# Altium schematic sheet modFOC-Top.SchDoc: modFOC-Top MCU
size A4; Author: Thomas Hofmann; CompanyName: HTL St. Pölten; Organization: Altium Limited; Address1: modFOC; Address2: Frenchs Forest; Address3: NSW; Address4: Australia 2086; DocumentNumber: 1; Revision: 2.0; SheetNumber: 1; SheetTotal: 7
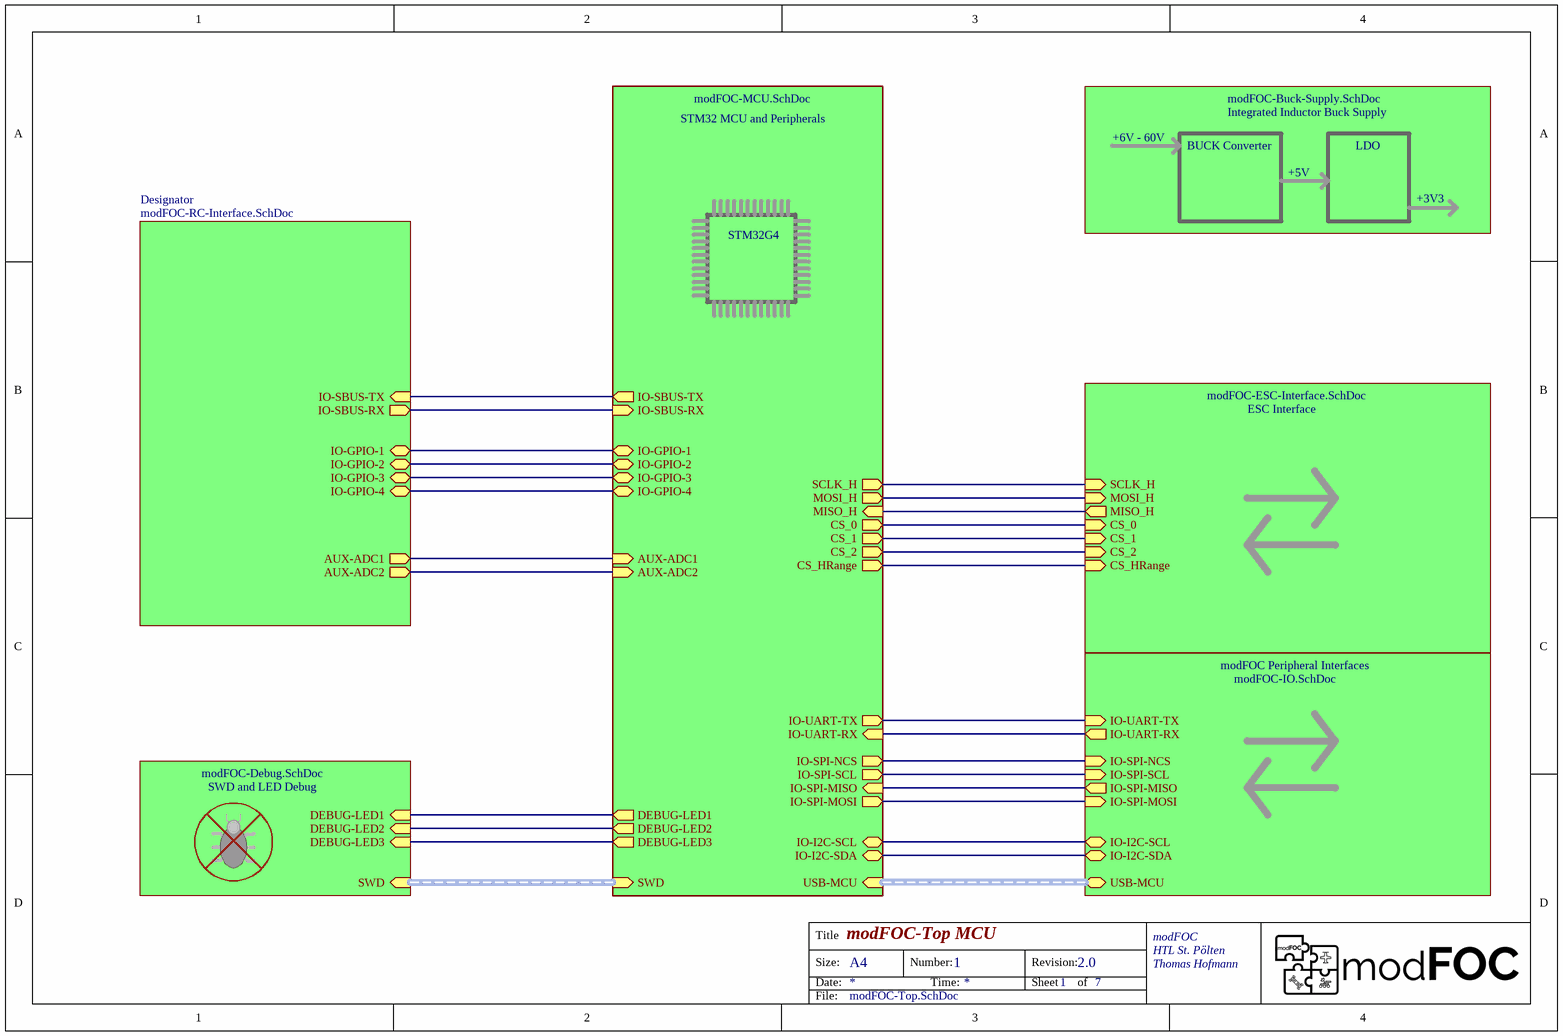
[diagram p0: modFOC-Top.SchDoc]

## Sub-sheets
Designator = modFOC-RC-Interface.SchDoc: IO-SBUS-TX (in), IO-SBUS-RX (out), IO-GPIO-1 (bidir), AUX-ADC2 (out), IO-GPIO-4 (bidir), AUX-ADC1 (out), IO-GPIO-3 (bidir), IO-GPIO-2 (bidir)
ESC Interface = modFOC-ESC-Interface.SchDoc: SCLK_H (in), MOSI_H (in), MISO_H (out), CS_0 (in), CS_1 (in), CS_2 (in), CS_HRange (in)
Integrated Inductor Buck Supply = modFOC-Buck-Supply.SchDoc: no entries
modFOC Peripheral Interfaces = modFOC-IO.SchDoc: USB-MCU (bidir, harness USB-HARNESS), IO-I2C-SDA (bidir), IO-I2C-SCL (bidir), IO-SPI-MOSI (in), IO-SPI-MISO (out), IO-SPI-SCL (in), IO-SPI-NCS (in), IO-UART-RX (out), IO-UART-TX (in)
STM32 MCU and Peripherals = modFOC-MCU.SchDoc: USB-MCU (in, harness USB-HARNESS), SWD (in, harness SWD-HARNESS), DEBUG-LED3 (out), DEBUG-LED2 (out), DEBUG-LED1 (out), IO-I2C-SDA (bidir), IO-I2C-SCL (bidir), IO-SPI-MOSI (out), IO-SPI-MISO (in), IO-SPI-SCL (out), IO-SPI-NCS (out), IO-UART-RX (in), IO-UART-TX (out), SCLK_H (out), MOSI_H (out), MISO_H (in), CS_0 (out), CS_1 (out), CS_2 (out), CS_HRange (out), IO-SBUS-TX (out), IO-SBUS-RX (in), IO-GPIO-1 (bidir), AUX-ADC2 (in), IO-GPIO-4 (bidir), AUX-ADC1 (in), IO-GPIO-3 (bidir), IO-GPIO-2 (bidir)
SWD and LED Debug = modFOC-Debug.SchDoc: SWD (in, harness SWD-HARNESS), DEBUG-LED3 (in), DEBUG-LED2 (in), DEBUG-LED1 (in)

## Nets
(unnamed): sheet modFOC Peripheral Interfaces/IO-I2C-SDA, sheet STM32 MCU and Peripherals/IO-I2C-SDA
(unnamed): sheet modFOC Peripheral Interfaces/IO-I2C-SCL, sheet STM32 MCU and Peripherals/IO-I2C-SCL
(unnamed): sheet modFOC Peripheral Interfaces/IO-SPI-MOSI, sheet STM32 MCU and Peripherals/IO-SPI-MOSI
(unnamed): sheet modFOC Peripheral Interfaces/IO-SPI-MISO, sheet STM32 MCU and Peripherals/IO-SPI-MISO
(unnamed): sheet modFOC Peripheral Interfaces/IO-SPI-SCL, sheet STM32 MCU and Peripherals/IO-SPI-SCL
(unnamed): sheet modFOC Peripheral Interfaces/IO-SPI-NCS, sheet STM32 MCU and Peripherals/IO-SPI-NCS
(unnamed): sheet modFOC Peripheral Interfaces/IO-UART-RX, sheet STM32 MCU and Peripherals/IO-UART-RX
(unnamed): sheet modFOC Peripheral Interfaces/IO-UART-TX, sheet STM32 MCU and Peripherals/IO-UART-TX
(unnamed): sheet STM32 MCU and Peripherals/DEBUG-LED3, sheet SWD and LED Debug/DEBUG-LED3
(unnamed): sheet STM32 MCU and Peripherals/DEBUG-LED2, sheet SWD and LED Debug/DEBUG-LED2
(unnamed): sheet STM32 MCU and Peripherals/DEBUG-LED1, sheet SWD and LED Debug/DEBUG-LED1
(unnamed): sheet STM32 MCU and Peripherals/SCLK_H, sheet ESC Interface/SCLK_H
(unnamed): sheet STM32 MCU and Peripherals/MOSI_H, sheet ESC Interface/MOSI_H
(unnamed): sheet STM32 MCU and Peripherals/MISO_H, sheet ESC Interface/MISO_H
(unnamed): sheet STM32 MCU and Peripherals/CS_0, sheet ESC Interface/CS_0
(unnamed): sheet STM32 MCU and Peripherals/CS_1, sheet ESC Interface/CS_1
(unnamed): sheet STM32 MCU and Peripherals/CS_2, sheet ESC Interface/CS_2
(unnamed): sheet STM32 MCU and Peripherals/CS_HRange, sheet ESC Interface/CS_HRange
(unnamed): sheet STM32 MCU and Peripherals/IO-SBUS-TX, sheet Designator/IO-SBUS-TX
(unnamed): sheet STM32 MCU and Peripherals/IO-SBUS-RX, sheet Designator/IO-SBUS-RX
(unnamed): sheet STM32 MCU and Peripherals/IO-GPIO-1, sheet Designator/IO-GPIO-1
(unnamed): sheet STM32 MCU and Peripherals/AUX-ADC2, sheet Designator/AUX-ADC2
(unnamed): sheet STM32 MCU and Peripherals/IO-GPIO-4, sheet Designator/IO-GPIO-4
(unnamed): sheet STM32 MCU and Peripherals/AUX-ADC1, sheet Designator/AUX-ADC1
(unnamed): sheet STM32 MCU and Peripherals/IO-GPIO-3, sheet Designator/IO-GPIO-3
(unnamed): sheet STM32 MCU and Peripherals/IO-GPIO-2, sheet Designator/IO-GPIO-2

## Buses and harness runs
harness sheet modFOC Peripheral Interfaces/USB-MCU = sheet STM32 MCU and Peripherals/USB-MCU
harness sheet STM32 MCU and Peripherals/SWD = sheet SWD and LED Debug/SWD

## Notes on the sheet
- +6V - 60V
- BUCK Converter
- +5V
- LDO
- STM32G4
- +3V3
- Title
- Size:
- Date:
- A4
- Number:
- Time:
- Revision:
- Sheet
- of
- File: